# Altium schematic sheet Switch_External.SchDoc
size A4; CompanyName: Technische Hochschule Nürnberg Georg Simon Ohm; Organization: UltraZohm; Address1: Kesslerplatz 12; Address2: 90489 Nürnberg; Address3: GERMANY; Website: www.ultrazohm.com
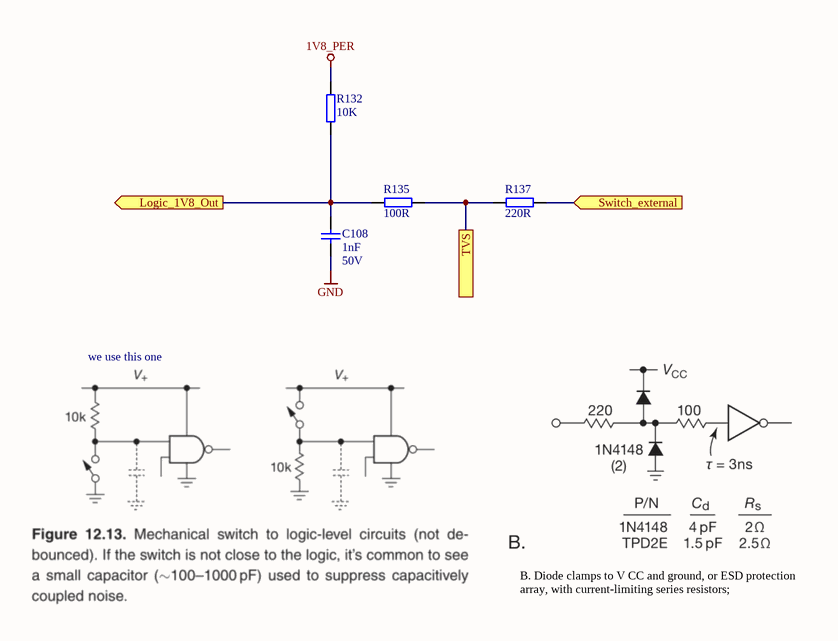
[diagram p0: Switch_External.SchDoc]

## Parts
C108  1nF  Voltage: 50V  [CAPC1608X90N_V]
R132  10K  [RESC1608X55N_V]
R135  100R  [RESC1608X55N_V]
R137  220R  [RESC1608X55N_V]

## Ports
Logic_1V8_Out (out), Switch_external (in), TVS

## Nets
1V8_PER: R132.2
GND: C108.1
Logic_1V8_Out: C108.2 R132.1 R135.1 ; port Logic_1V8_Out
Switch_external: R137.1 ; port Switch_external
TVS: R135.2 R137.2 ; port TVS

## Notes on the sheet
- we use this one
- B. Diode clamps to V CC and ground, or ESD protection array, with current-limiting series resistors;
- Title
- Revision:
- Design Engineer:
- Date:
- Project:
- Sheet
- of

## Library data of the parts
C108 = 22523: KON 1nF 50V NP0 5% SMD BF 1608 (0603); Value: 1n; AN: 22523; Mixed: SMT; Technology: NP0; Case: 1608 (0603)
R132 = 21492: WID SMD 10K 1% 0,1W  BF 1608 (0603); AN: 21492; Mixed: SMT; Preferred: Yes; Value: 10K; Tolerance: 1%; Case: 1608 (0603); Technology: TK100
R135 = 21380: WID SMD 100R 1% 0,1W BF 1608 (0603); Value: 100; AN: 21380; Mixed: SMT; Preferred: Yes; Tolerance: 1%; Case: 1608 (0603); Technology: TK100
R137 = 22324: WID SMD 220R 1% 0,1W; Value: 220; AN: 22324; Mixed: SMT; Extra: BF 1608 (0603); Tolerance: 1%; Case: 1608 (0603); Technology: TK100